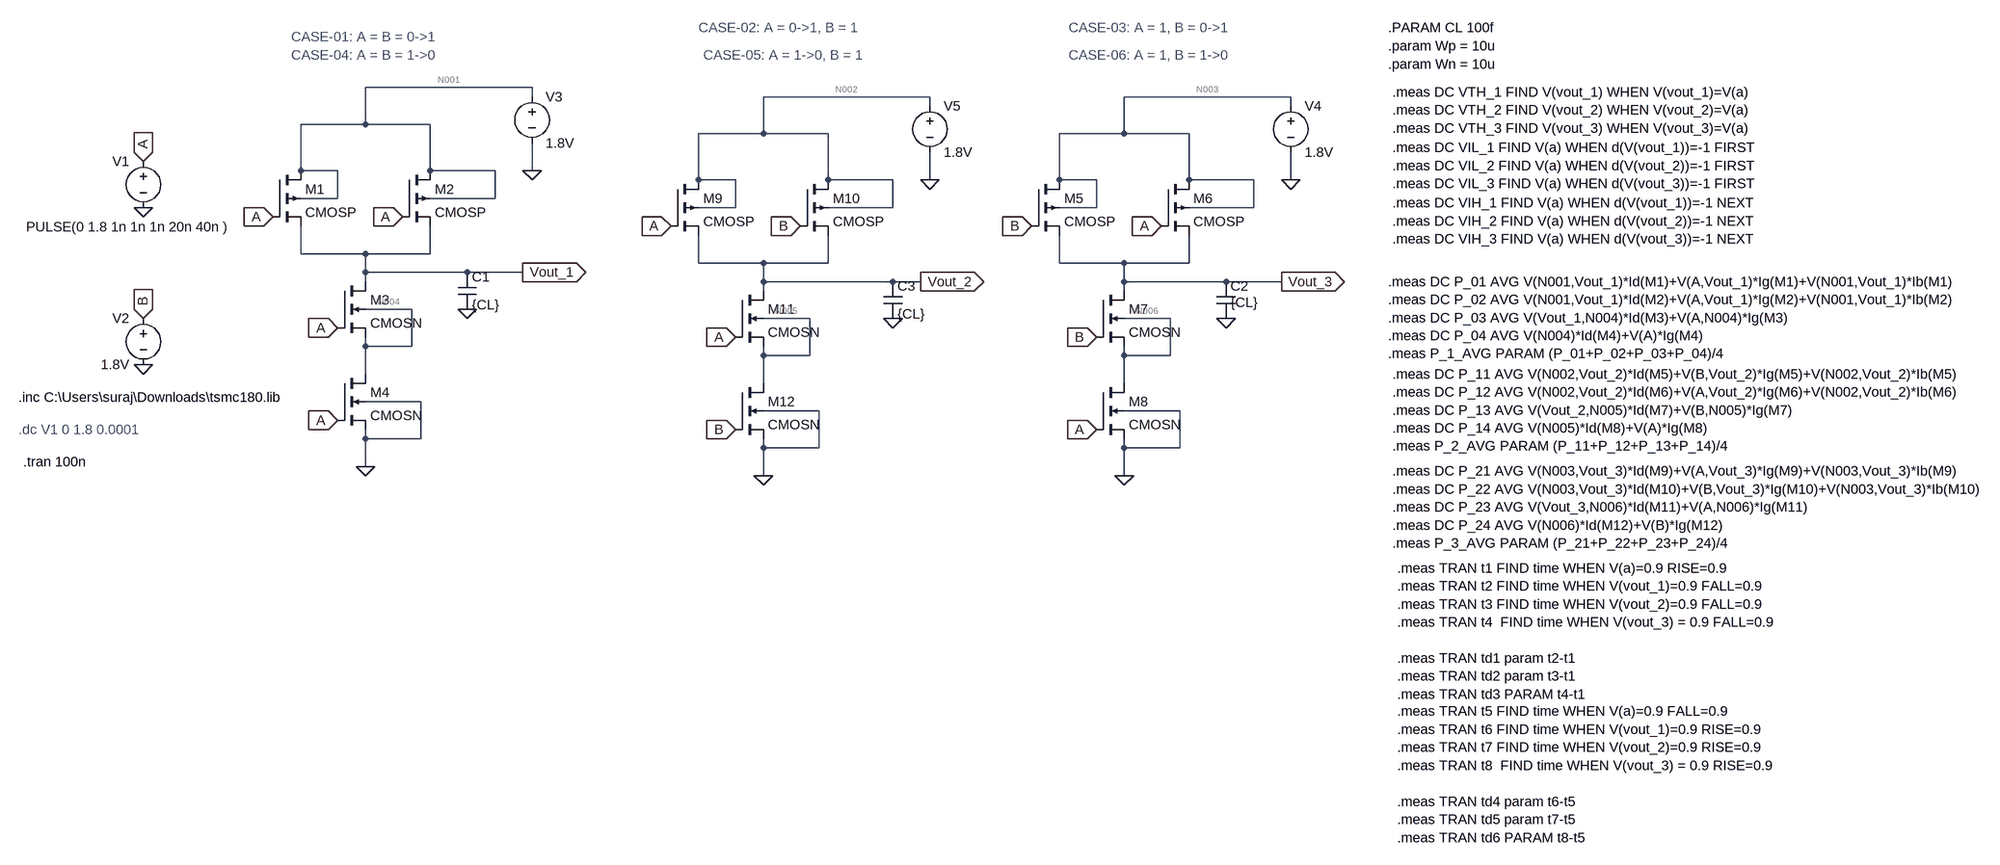
[diagram p0: schematic NAND_180nm.asc]
NAND_180nm.asc, the LTspice schematic file:
Version 4
SHEET 1 5580 1748
WIRE 544 -128 256 -128
WIRE 544 -112 544 -128
WIRE 1232 -112 944 -112
WIRE 1856 -112 1568 -112
WIRE 1232 -96 1232 -112
WIRE 1856 -96 1856 -112
WIRE 256 -64 256 -128
WIRE 256 -64 144 -64
WIRE 368 -64 256 -64
WIRE 944 -48 944 -112
WIRE 944 -48 832 -48
WIRE 1056 -48 944 -48
WIRE 1568 -48 1568 -112
WIRE 1568 -48 1456 -48
WIRE 1680 -48 1568 -48
WIRE 144 16 144 -64
WIRE 208 16 144 16
WIRE 368 16 368 -64
WIRE 480 16 368 16
WIRE 544 16 544 -32
WIRE 368 32 368 16
WIRE 832 32 832 -48
WIRE 896 32 832 32
WIRE 1056 32 1056 -48
WIRE 1168 32 1056 32
WIRE 1232 32 1232 -16
WIRE 1456 32 1456 -48
WIRE 1520 32 1456 32
WIRE 1680 32 1680 -48
WIRE 1792 32 1680 32
WIRE 1856 32 1856 -16
WIRE 1056 48 1056 32
WIRE 1680 48 1680 32
WIRE 208 64 208 16
WIRE 208 64 144 64
WIRE 480 64 480 16
WIRE 480 64 368 64
WIRE 896 80 896 32
WIRE 896 80 832 80
WIRE 1168 80 1168 32
WIRE 1168 80 1056 80
WIRE 1520 80 1520 32
WIRE 1520 80 1456 80
WIRE 1792 80 1792 32
WIRE 1792 80 1680 80
WIRE 144 160 144 112
WIRE 256 160 144 160
WIRE 368 160 368 112
WIRE 368 160 256 160
WIRE 832 176 832 128
WIRE 944 176 832 176
WIRE 1056 176 1056 128
WIRE 1056 176 944 176
WIRE 1456 176 1456 128
WIRE 1568 176 1456 176
WIRE 1680 176 1680 128
WIRE 1680 176 1568 176
WIRE 256 192 256 160
WIRE 432 192 256 192
WIRE 528 192 432 192
WIRE 256 208 256 192
WIRE 944 208 944 176
WIRE 1168 208 944 208
WIRE 1216 208 1168 208
WIRE 1568 208 1568 176
WIRE 1744 208 1568 208
WIRE 1840 208 1744 208
WIRE 944 224 944 208
WIRE 1568 224 1568 208
WIRE 336 256 256 256
WIRE 1024 272 944 272
WIRE 1648 272 1568 272
WIRE 256 320 256 304
WIRE 336 320 336 256
WIRE 336 320 256 320
WIRE 944 336 944 320
WIRE 1024 336 1024 272
WIRE 1024 336 944 336
WIRE 1568 336 1568 320
WIRE 1648 336 1648 272
WIRE 1648 336 1568 336
WIRE 256 368 256 320
WIRE 944 384 944 336
WIRE 1568 384 1568 336
WIRE 352 416 256 416
WIRE 1040 432 944 432
WIRE 1664 432 1568 432
WIRE 256 480 256 464
WIRE 352 480 352 416
WIRE 352 480 256 480
WIRE 944 496 944 480
WIRE 1040 496 1040 432
WIRE 1040 496 944 496
WIRE 1568 496 1568 480
WIRE 1664 496 1664 432
WIRE 1664 496 1568 496
WIRE 256 528 256 480
WIRE 944 544 944 496
WIRE 1568 544 1568 496
FLAG 256 528 0
FLAG 544 16 0
FLAG -128 352 0
FLAG -128 80 0
FLAG -128 272 B
IOPIN -128 272 In
FLAG 96 96 A
IOPIN 96 96 In
FLAG 208 288 A
IOPIN 208 288 In
FLAG -128 0 A
IOPIN -128 0 In
FLAG 208 448 A
IOPIN 208 448 In
FLAG 320 96 A
IOPIN 320 96 In
FLAG 528 192 Vout_1
IOPIN 528 192 Out
FLAG 1568 544 0
FLAG 1856 32 0
FLAG 1408 112 B
IOPIN 1408 112 In
FLAG 1520 304 B
IOPIN 1520 304 In
FLAG 1520 464 A
IOPIN 1520 464 In
FLAG 1632 112 A
IOPIN 1632 112 In
FLAG 1840 208 Vout_3
IOPIN 1840 208 Out
FLAG 944 544 0
FLAG 1232 32 0
FLAG 784 112 A
IOPIN 784 112 In
FLAG 896 304 A
IOPIN 896 304 In
FLAG 896 464 B
IOPIN 896 464 In
FLAG 1008 112 B
IOPIN 1008 112 In
FLAG 1216 208 Vout_2
IOPIN 1216 208 Out
FLAG 432 256 0
FLAG 1744 272 0
FLAG 1168 272 0
SYMBOL pmos4 96 16 R0
SYMATTR InstName M1
SYMATTR Value CMOSP
SYMATTR Value2 l=0.18u w=Wp
SYMBOL pmos4 320 16 R0
SYMATTR InstName M2
SYMATTR Value CMOSP
SYMATTR Value2 l=0.18u w=Wp
SYMBOL nmos4 208 208 R0
SYMATTR InstName M3
SYMATTR Value CMOSN
SYMATTR Value2 l=0.18u w=Wn
SYMBOL nmos4 208 368 R0
SYMATTR InstName M4
SYMATTR Value CMOSN
SYMATTR Value2 l=0.18u w=10u
SYMBOL voltage 544 -128 R0
WINDOW 123 0 0 Left 0
WINDOW 39 0 0 Left 0
SYMATTR InstName V3
SYMATTR Value 1.8V
SYMBOL pmos4 1408 32 R0
SYMATTR InstName M5
SYMATTR Value CMOSP
SYMATTR Value2 l=0.18u w=Wp
SYMBOL pmos4 1632 32 R0
SYMATTR InstName M6
SYMATTR Value CMOSP
SYMATTR Value2 l=0.18u w=Wp
SYMBOL nmos4 1520 224 R0
SYMATTR InstName M7
SYMATTR Value CMOSN
SYMATTR Value2 l=0.18u w=Wn
SYMBOL nmos4 1520 384 R0
SYMATTR InstName M8
SYMATTR Value CMOSN
SYMATTR Value2 l=0.18u w=Wn
SYMBOL voltage 1856 -112 R0
WINDOW 123 0 0 Left 0
WINDOW 39 0 0 Left 0
SYMATTR InstName V4
SYMATTR Value 1.8V
SYMBOL pmos4 784 32 R0
SYMATTR InstName M9
SYMATTR Value CMOSP
SYMATTR Value2 l=0.18u w=Wp
SYMBOL pmos4 1008 32 R0
SYMATTR InstName M10
SYMATTR Value CMOSP
SYMATTR Value2 l=0.18u w=Wp
SYMBOL nmos4 896 224 R0
SYMATTR InstName M11
SYMATTR Value CMOSN
SYMATTR Value2 l=0.18u w=Wn
SYMBOL nmos4 896 384 R0
SYMATTR InstName M12
SYMATTR Value CMOSN
SYMATTR Value2 l=0.18u w=Wn
SYMBOL voltage 1232 -112 R0
WINDOW 123 0 0 Left 0
WINDOW 39 0 0 Left 0
SYMATTR InstName V5
SYMATTR Value 1.8V
SYMBOL voltage -128 -16 M0
WINDOW 123 0 0 Left 0
WINDOW 39 0 0 Left 0
WINDOW 3 -148 129 Left 2
SYMATTR Value PULSE(0 1.8 1n 1n 1n 20n 40n )
SYMATTR InstName V1
SYMBOL voltage -128 256 M0
SYMATTR InstName V2
SYMATTR Value 1.8V
SYMBOL cap 416 192 R0
SYMATTR InstName C1
SYMATTR Value {CL}
SYMBOL cap 1728 208 R0
WINDOW 3 24 36 Left 2
SYMATTR Value {CL}
SYMATTR InstName C2
SYMBOL cap 1152 208 R0
SYMATTR InstName C3
SYMATTR Value {CL}
TEXT -344 408 Left 2 !.inc C:\\Users\\suraj\\Downloads\\tsmc180.lib
TEXT -344 464 Left 2 ;.dc V1 0 1.8 0.0001
TEXT -336 520 Left 2 !.tran 100n
TEXT 128 -216 Left 2 ;CASE-01: A = B = 0->1
TEXT 1472 -232 Left 2 ;CASE-03: A = 1, B = 0->1
TEXT 832 -232 Left 2 ;CASE-02: A = 0->1, B = 1
TEXT 128 -184 Left 2 ;CASE-04: A = B = 1->0
TEXT 1472 -184 Left 2 ;CASE-06: A = 1, B = 1->0
TEXT 840 -184 Left 2 ;CASE-05: A = 1->0, B = 1
TEXT 2024 -200 Left 2 !.param Wp = 10u
TEXT 2024 -168 Left 2 !.param Wn = 10u
TEXT 2032 -120 Left 2 !.meas DC VTH_1 FIND V(vout_1) WHEN V(vout_1)=V(a)\n.meas DC VTH_2 FIND V(vout_2) WHEN V(vout_2)=V(a)\n.meas DC VTH_3 FIND V(vout_3) WHEN V(vout_3)=V(a)
TEXT 2032 -24 Left 2 !.meas DC VIL_1 FIND V(a) WHEN d(V(vout_1))=-1 FIRST\n.meas DC VIL_2 FIND V(a) WHEN d(V(vout_2))=-1 FIRST\n.meas DC VIL_3 FIND V(a) WHEN d(V(vout_3))=-1 FIRST
TEXT 2032 72 Left 2 !.meas DC VIH_1 FIND V(a) WHEN d(V(vout_1))=-1 NEXT\n.meas DC VIH_2 FIND V(a) WHEN d(V(vout_2))=-1 NEXT\n.meas DC VIH_3 FIND V(a) WHEN d(V(vout_3))=-1 NEXT
TEXT 2024 208 Left 2 !.meas DC P_01 AVG V(N001,Vout_1)*Id(M1)+V(A,Vout_1)*Ig(M1)+V(N001,Vout_1)*Ib(M1)\n.meas DC P_02 AVG V(N001,Vout_1)*Id(M2)+V(A,Vout_1)*Ig(M2)+V(N001,Vout_1)*Ib(M2)\n.meas DC P_03 AVG V(Vout_1,N004)*Id(M3)+V(A,N004)*Ig(M3)\n.meas DC P_04 AVG V(N004)*Id(M4)+V(A)*Ig(M4)\n.meas P_1_AVG PARAM (P_01+P_02+P_03+P_04)/4
TEXT 2032 368 Left 2 !.meas DC P_11 AVG V(N002,Vout_2)*Id(M5)+V(B,Vout_2)*Ig(M5)+V(N002,Vout_2)*Ib(M5)\n.meas DC P_12 AVG V(N002,Vout_2)*Id(M6)+V(A,Vout_2)*Ig(M6)+V(N002,Vout_2)*Ib(M6)\n.meas DC P_13 AVG V(Vout_2,N005)*Id(M7)+V(B,N005)*Ig(M7)\n.meas DC P_14 AVG V(N005)*Id(M8)+V(A)*Ig(M8)\n.meas P_2_AVG PARAM (P_11+P_12+P_13+P_14)/4
TEXT 2032 536 Left 2 !.meas DC P_21 AVG V(N003,Vout_3)*Id(M9)+V(A,Vout_3)*Ig(M9)+V(N003,Vout_3)*Ib(M9)\n.meas DC P_22 AVG V(N003,Vout_3)*Id(M10)+V(B,Vout_3)*Ig(M10)+V(N003,Vout_3)*Ib(M10)\n.meas DC P_23 AVG V(Vout_3,N006)*Id(M11)+V(A,N006)*Ig(M11)\n.meas DC P_24 AVG V(N006)*Id(M12)+V(B)*Ig(M12)\n.meas P_3_AVG PARAM (P_21+P_22+P_23+P_24)/4
TEXT 2040 704 Left 2 !.meas TRAN t1 FIND time WHEN V(a)=0.9 RISE=0.9\n.meas TRAN t2 FIND time WHEN V(vout_1)=0.9 FALL=0.9\n.meas TRAN t3 FIND time WHEN V(vout_2)=0.9 FALL=0.9\n.meas TRAN t4  FIND time WHEN V(vout_3) = 0.9 FALL=0.9\n \n.meas TRAN td1 param t2-t1\n.meas TRAN td2 param t3-t1\n.meas TRAN td3 PARAM t4-t1
TEXT 2040 952 Left 2 !.meas TRAN t5 FIND time WHEN V(a)=0.9 FALL=0.9\n.meas TRAN t6 FIND time WHEN V(vout_1)=0.9 RISE=0.9\n.meas TRAN t7 FIND time WHEN V(vout_2)=0.9 RISE=0.9\n.meas TRAN t8  FIND time WHEN V(vout_3) = 0.9 RISE=0.9\n \n.meas TRAN td4 param t6-t5\n.meas TRAN td5 param t7-t5\n.meas TRAN td6 PARAM t8-t5
TEXT 2024 -232 Left 2 !.PARAM CL 100f

The netlist it stands for:
* NAND_180nm.asc
M1 N001 A Vout_1 N001 CMOSP l=0.18u w=Wp
M2 N001 A Vout_1 N001 CMOSP l=0.18u w=Wp
M3 Vout_1 A N004 N004 CMOSN l=0.18u w=Wn
M4 N004 A 0 0 CMOSN l=0.18u w=10u
V3 N001 0 1.8V
M5 N003 B Vout_3 N003 CMOSP l=0.18u w=Wp
M6 N003 A Vout_3 N003 CMOSP l=0.18u w=Wp
M7 Vout_3 B N006 N006 CMOSN l=0.18u w=Wn
M8 N006 A 0 0 CMOSN l=0.18u w=Wn
V4 N003 0 1.8V
M9 N002 A Vout_2 N002 CMOSP l=0.18u w=Wp
M10 N002 B Vout_2 N002 CMOSP l=0.18u w=Wp
M11 Vout_2 A N005 N005 CMOSN l=0.18u w=Wn
M12 N005 B 0 0 CMOSN l=0.18u w=Wn
V5 N002 0 1.8V
V1 A 0 PULSE(0 1.8 1n 1n 1n 20n 40n )
V2 B 0 1.8V
C1 Vout_1 0 {CL}
C2 Vout_3 0 {CL}
C3 Vout_2 0 {CL}
.model NMOS NMOS
.model PMOS PMOS
.lib standard.mos
.inc C:\Users\suraj\Downloads\tsmc180.lib
* .dc V1 0 1.8 0.0001
.tran 100n
* CASE-01: A = B = 0->1
* CASE-03: A = 1, B = 0->1
* CASE-02: A = 0->1, B = 1
* CASE-04: A = B = 1->0
* CASE-06: A = 1, B = 1->0
* CASE-05: A = 1->0, B = 1
.param Wp = 10u
.param Wn = 10u
.meas DC VTH_1 FIND V(vout_1) WHEN V(vout_1)=V(a)
.meas DC VTH_2 FIND V(vout_2) WHEN V(vout_2)=V(a)
.meas DC VTH_3 FIND V(vout_3) WHEN V(vout_3)=V(a)
.meas DC VIL_1 FIND V(a) WHEN d(V(vout_1))=-1 FIRST
.meas DC VIL_2 FIND V(a) WHEN d(V(vout_2))=-1 FIRST
.meas DC VIL_3 FIND V(a) WHEN d(V(vout_3))=-1 FIRST
.meas DC VIH_1 FIND V(a) WHEN d(V(vout_1))=-1 NEXT
.meas DC VIH_2 FIND V(a) WHEN d(V(vout_2))=-1 NEXT
.meas DC VIH_3 FIND V(a) WHEN d(V(vout_3))=-1 NEXT
.meas DC P_01 AVG V(N001,Vout_1)*Id(M1)+V(A,Vout_1)*Ig(M1)+V(N001,Vout_1)*Ib(M1)
.meas DC P_02 AVG V(N001,Vout_1)*Id(M2)+V(A,Vout_1)*Ig(M2)+V(N001,Vout_1)*Ib(M2)
.meas DC P_03 AVG V(Vout_1,N004)*Id(M3)+V(A,N004)*Ig(M3)
.meas DC P_04 AVG V(N004)*Id(M4)+V(A)*Ig(M4)
.meas P_1_AVG PARAM (P_01+P_02+P_03+P_04)/4
.meas DC P_11 AVG V(N002,Vout_2)*Id(M5)+V(B,Vout_2)*Ig(M5)+V(N002,Vout_2)*Ib(M5)
.meas DC P_12 AVG V(N002,Vout_2)*Id(M6)+V(A,Vout_2)*Ig(M6)+V(N002,Vout_2)*Ib(M6)
.meas DC P_13 AVG V(Vout_2,N005)*Id(M7)+V(B,N005)*Ig(M7)
.meas DC P_14 AVG V(N005)*Id(M8)+V(A)*Ig(M8)
.meas P_2_AVG PARAM (P_11+P_12+P_13+P_14)/4
.meas DC P_21 AVG V(N003,Vout_3)*Id(M9)+V(A,Vout_3)*Ig(M9)+V(N003,Vout_3)*Ib(M9)
.meas DC P_22 AVG V(N003,Vout_3)*Id(M10)+V(B,Vout_3)*Ig(M10)+V(N003,Vout_3)*Ib(M10)
.meas DC P_23 AVG V(Vout_3,N006)*Id(M11)+V(A,N006)*Ig(M11)
.meas DC P_24 AVG V(N006)*Id(M12)+V(B)*Ig(M12)
.meas P_3_AVG PARAM (P_21+P_22+P_23+P_24)/4
.meas TRAN t1 FIND time WHEN V(a)=0.9 RISE=0.9
.meas TRAN t2 FIND time WHEN V(vout_1)=0.9 FALL=0.9
.meas TRAN t3 FIND time WHEN V(vout_2)=0.9 FALL=0.9
.meas TRAN t4  FIND time WHEN V(vout_3) = 0.9 FALL=0.9
.meas TRAN td1 param t2-t1
.meas TRAN td2 param t3-t1
.meas TRAN td3 PARAM t4-t1
.meas TRAN t5 FIND time WHEN V(a)=0.9 FALL=0.9
.meas TRAN t6 FIND time WHEN V(vout_1)=0.9 RISE=0.9
.meas TRAN t7 FIND time WHEN V(vout_2)=0.9 RISE=0.9
.meas TRAN t8  FIND time WHEN V(vout_3) = 0.9 RISE=0.9
.meas TRAN td4 param t6-t5
.meas TRAN td5 param t7-t5
.meas TRAN td6 PARAM t8-t5
.PARAM CL 100f
.backanno
.end